# Altium schematic sheet ANALOG.SchDoc
size A; SheetNumber: 12; SheetTotal: 21
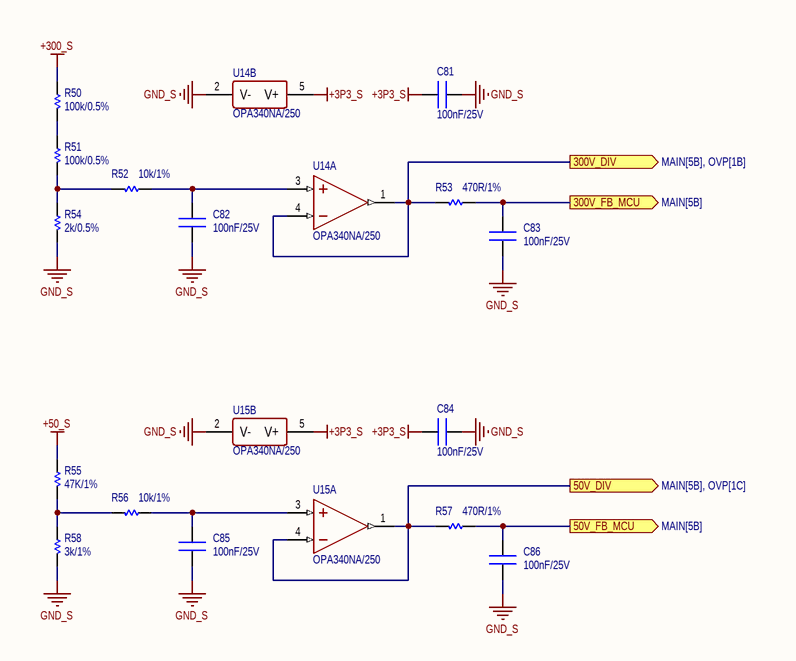
[diagram p0: ANALOG.SchDoc]

## Parts
C81  100nF/25V  [CN-SMD-0603]
C82  100nF/25V  [CN-SMD-0603]
C83  100nF/25V  [CN-SMD-0603]
C84  100nF/25V  [CN-SMD-0603]
C85  100nF/25V  [CN-SMD-0603]
C86  100nF/25V  [CN-SMD-0603]
R50  100k/0.5%  [RES-SMD-2010]
R51  100k/0.5%  [RES-SMD-2010]
R52  10k/1%  [RES-SMD-0603]
R53  470R/1%  [RES-SMD-0603]
R54  2k/0.5%  [RES-SMD-2010]
R55  47K/1%  [RES-SMD-0603]
R56  10k/1%  [RES-SMD-0603]
R57  470R/1%  [RES-SMD-0603]
R58  3k/1%  [RES-SMD-0603]
U14  OPA340NA/250  [SOT23-5]  (parts A,B of 2)
U15  OPA340NA/250  [SOT23-5]  (parts A,B of 2)

## Ports
50V_DIV (out, see MAIN[5B], OVP[1C]), 50V_FB_MCU (out, see MAIN[5B]), 300V_DIV (out, see MAIN[5B], OVP[1B]), 300V_FB_MCU (out, see MAIN[5B])

## Nets
+3P3_S: C81.1 C84.1 U14.5(V+) U15.5(V+)
+50_S: R55.1
+300_S: R50.1
GND_S: C81.2 C82.2 C83.2 C84.2 C85.2 C86.2 R54.2 R58.2 U14.2(V-) U15.2(V-)
50V_DIV: R57.2 U15.1(OUT) U15.4(IN-) ; port 50V_DIV
50V_FB_MCU: C86.1 R57.1 ; port 50V_FB_MCU
300V_DIV: R53.2 U14.1(OUT) U14.4(IN-) ; port 300V_DIV
300V_FB_MCU: C83.1 R53.1 ; port 300V_FB_MCU
NetC82_1: C82.1 R52.1 U14.3(IN+)
NetC85_1: C85.1 R56.1 U15.3(IN+)
NetR50_2: R50.2 R51.1
NetR51_2: R51.2 R52.2 R54.1
NetR55_2: R55.2 R56.2 R58.1

## Library data of the parts
C81-C86 = CN: CL10B104KA8NNNC; PN: CL10B104KA8NNNC
R50 R51 = Res-SMD: CHV2010-JW-104ELF; Manufacturer: Generic Components; Class: Passive; PN: CHV2010-JW-104ELF; Publisher: Altium Hobart Technology Centre
R52 R56 = Res-SMD: ERJ-3EKF1002V; Manufacturer: Generic Components; Class: Passive; PN: ERJ-3EKF1002V; Publisher: Altium Hobart Technology Centre
R53 R57 = Res-SMD: ERJ-1GJF4700C; Manufacturer: Generic Components; Class: Passive; PN: ERJ-1GJF4700C; Publisher: Altium Hobart Technology Centre
R54 = Res-SMD: CRCW20102K00FKEFHP; Manufacturer: Generic Components; Class: Passive; PN: CRCW20102K00FKEFHP; Publisher: Altium Hobart Technology Centre
R55 = Res-SMD: ERJ-3EKF4702V; Manufacturer: Generic Components; Class: Passive; PN: ERJ-3EKF4702V; Publisher: Altium Hobart Technology Centre
R58 = Res-SMD: ERA-3AEB302V; Manufacturer: Generic Components; Class: Passive; PN: ERA-3AEB302V; Publisher: Altium Hobart Technology Centre
U14 U15 = OPA340DBV: PN: OPA340NA/250